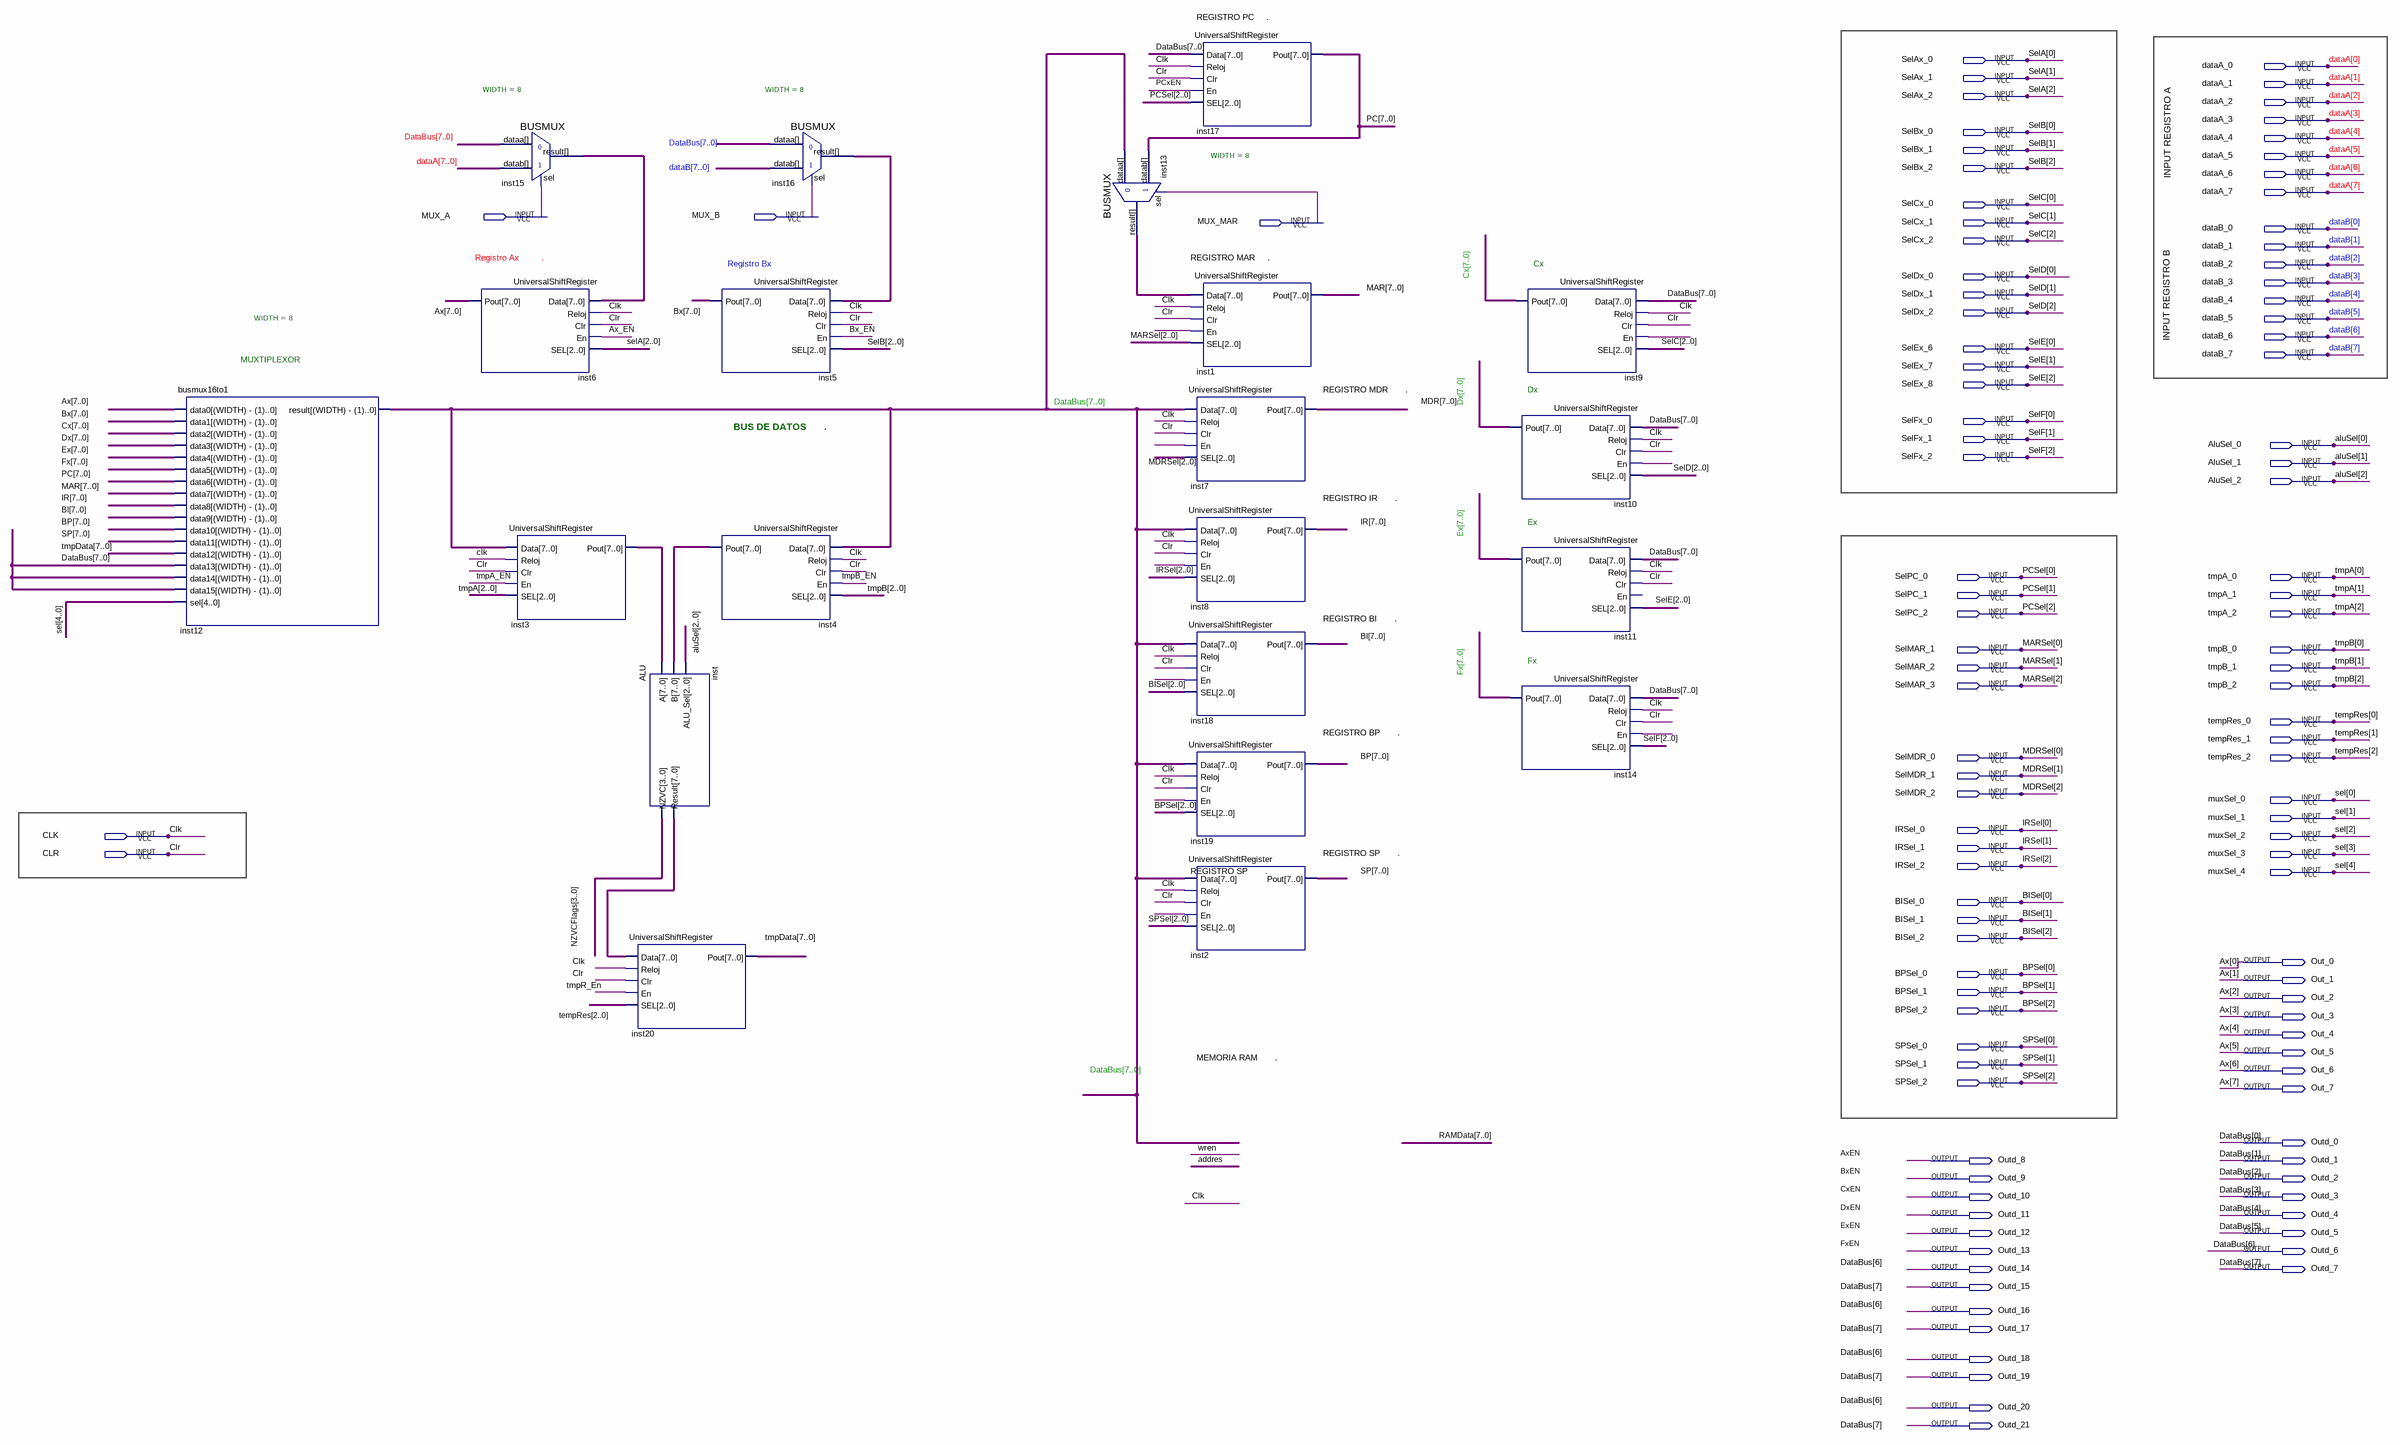
[diagram p0: schematic sheet]
// Quartus schematic ElMicro_2.bdf as structural Verilog: 21 symbols, 107 pins
module ElMicro_2 (
  input  SelAx_0,
  input  dataA_0,
  input  SelAx_1,
  input  dataA_1,
  input  SelAx_2,
  input  dataA_2,
  input  dataA_3,
  input  SelBx_0,
  input  dataA_4,
  input  SelBx_1,
  input  dataA_5,
  input  SelBx_2,
  input  dataA_6,
  input  dataA_7,
  input  SelCx_0,
  input  MUX_A,
  input  MUX_B,
  input  MUX_MAR,
  input  SelCx_1,
  input  dataB_0,
  input  SelCx_2,
  input  dataB_1,
  input  dataB_2,
  input  SelDx_0,
  input  dataB_3,
  input  SelDx_1,
  input  dataB_4,
  input  SelDx_2,
  input  dataB_5,
  input  dataB_6,
  input  SelEx_6,
  input  dataB_7,
  input  SelEx_7,
  input  SelEx_8,
  input  SelFx_0,
  input  SelFx_1,
  input  AluSel_0,
  input  SelFx_2,
  input  AluSel_1,
  input  AluSel_2,
  input  SelPC_0,
  input  tmpA_0,
  input  SelPC_1,
  input  tmpA_1,
  input  SelPC_2,
  input  tmpA_2,
  input  SelMAR_1,
  input  tmpB_0,
  input  SelMAR_2,
  input  tmpB_1,
  input  SelMAR_3,
  input  tmpB_2,
  input  tempRes_0,
  input  tempRes_1,
  input  SelMDR_0,
  input  tempRes_2,
  input  SelMDR_1,
  input  SelMDR_2,
  input  muxSel_0,
  input  muxSel_1,
  input  IRSel_0,
  input  CLK,
  input  muxSel_2,
  input  IRSel_1,
  input  CLR,
  input  muxSel_3,
  input  IRSel_2,
  input  muxSel_4,
  input  BISel_0,
  input  BISel_1,
  input  BISel_2,
  input  BPSel_0,
  input  BPSel_1,
  input  BPSel_2,
  input  SPSel_0,
  input  SPSel_1,
  input  SPSel_2,
  output Out_0,
  output Out_1,
  output Out_2,
  output Out_3,
  output Out_4,
  output Out_5,
  output Out_6,
  output Out_7,
  output Outd_0,
  output Outd_8,
  output Outd_1,
  output Outd_9,
  output Outd_2,
  output Outd_10,
  output Outd_3,
  output Outd_11,
  output Outd_4,
  output Outd_12,
  output Outd_5,
  output Outd_13,
  output Outd_6,
  output Outd_14,
  output Outd_7,
  output Outd_15,
  output Outd_16,
  output Outd_17,
  output Outd_18,
  output Outd_19,
  output Outd_20,
  output Outd_21
);

  wire Ax_EN, Bx_EN, PCxEN, tmpA_EN, tmpB_EN, tmpR_En, undriven, undriven_2, undriven_3, undriven_4,
       undriven_5, undriven_6, undriven_7, undriven_8, undriven_9, undriven_10, undriven_11, undriven_12;
  wire [3:0] NZVCFlags;
  wire [7:0] BI, BP, Bx, Cx, Dx, Ex, Fx, inst3_pout, inst4_pout, inst13_result, inst15_result, inst16_result,
       inst_result, IR, MAR, MDR, PC, SP, tmpData;

  busmux16to1 #(.WIDTH(8)) inst12 (
    .data0({Out_7, Out_6, Out_5, Out_4, Out_3, Out_2, Out_1, Out_0}), .data1(Bx), .data2(Cx), .data3(Dx),
    .data4(Ex), .data5(Fx), .data6(PC), .data7(MAR), .data8(IR), .data9(BI), .data10(BP), .data11(SP),
    .data12(tmpData), .data13({Outd_7, Outd_6, Outd_5, Outd_4, Outd_3, Outd_2, Outd_1, Outd_0}),
    .data14({Outd_7, Outd_6, Outd_5, Outd_4, Outd_3, Outd_2, Outd_1, Outd_0}),
    .data15({Outd_7, Outd_6, Outd_5, Outd_4, Outd_3, Outd_2, Outd_1, Outd_0}),
    .sel({muxSel_4, muxSel_3, muxSel_2, muxSel_1, muxSel_0}),
    .result({Outd_7, Outd_6, Outd_5, Outd_4, Outd_3, Outd_2, Outd_1, Outd_0}));
  BUSMUX #(.WIDTH(8)) inst15 (
    .datab({dataA_7, dataA_6, dataA_5, dataA_4, dataA_3, dataA_2, dataA_1, dataA_0}), .sel(undriven_3),
    .dataa({Outd_7, Outd_6, Outd_5, Outd_4, Outd_3, Outd_2, Outd_1, Outd_0}), .result(inst15_result));
  UniversalShiftRegister inst6 (
    .Data(inst15_result), .Reloj(CLK), .Clr(CLR), .En(Ax_EN), .SEL({SelAx_2, SelAx_1, SelAx_0}),
    .Pout({Out_7, Out_6, Out_5, Out_4, Out_3, Out_2, Out_1, Out_0}));
  UniversalShiftRegister inst3 (
    .Data({Outd_7, Outd_6, Outd_5, Outd_4, Outd_3, Outd_2, Outd_1, Outd_0}), .Reloj(CLK), .Clr(CLR),
    .En(tmpA_EN), .SEL({tmpA_2, tmpA_1, tmpA_0}), .Pout(inst3_pout));
  ALU inst (
    .A(inst3_pout), .B(inst4_pout), .ALU_Sel({AluSel_2, AluSel_1, AluSel_0}), .NZVC(NZVCFlags),
    .Result(inst_result));
  UniversalShiftRegister inst20 (
    .Data(inst_result), .Reloj(CLK), .Clr(CLR), .En(tmpR_En), .SEL({tempRes_2, tempRes_1, tempRes_0}),
    .Pout(tmpData));
  UniversalShiftRegister inst5 (
    .Data(inst16_result), .Reloj(CLK), .Clr(CLR), .En(Bx_EN), .SEL({SelBx_2, SelBx_1, SelBx_0}), .Pout(Bx));
  UniversalShiftRegister inst4 (
    .Data({Outd_7, Outd_6, Outd_5, Outd_4, Outd_3, Outd_2, Outd_1, Outd_0}), .Reloj(CLK), .Clr(CLR),
    .En(tmpB_EN), .SEL({tmpB_2, tmpB_1, tmpB_0}), .Pout(inst4_pout));
  BUSMUX #(.WIDTH(8)) inst16 (
    .datab({dataB_7, dataB_6, dataB_5, dataB_4, dataB_3, dataB_2, dataB_1, dataB_0}), .sel(undriven_2),
    .dataa({Outd_7, Outd_6, Outd_5, Outd_4, Outd_3, Outd_2, Outd_1, Outd_0}), .result(inst16_result));
  BUSMUX #(.WIDTH(8)) inst13 (
    .datab(PC), .sel(undriven), .dataa({Outd_7, Outd_6, Outd_5, Outd_4, Outd_3, Outd_2, Outd_1, Outd_0}),
    .result(inst13_result));
  UniversalShiftRegister inst17 (
    .Data({Outd_7, Outd_6, Outd_5, Outd_4, Outd_3, Outd_2, Outd_1, Outd_0}), .Reloj(CLK), .Clr(CLR),
    .En(PCxEN), .SEL({SelPC_2, SelPC_1, SelPC_0}), .Pout(PC));
  UniversalShiftRegister inst1 (
    .Data(inst13_result), .Reloj(CLK), .Clr(CLR), .En(undriven_11), .SEL({SelMAR_3, SelMAR_2, SelMAR_1}),
    .Pout(MAR));
  UniversalShiftRegister inst7 (
    .Data({Outd_7, Outd_6, Outd_5, Outd_4, Outd_3, Outd_2, Outd_1, Outd_0}), .Reloj(CLK), .Clr(CLR),
    .En(undriven_12), .SEL({SelMDR_2, SelMDR_1, SelMDR_0}), .Pout(MDR));
  UniversalShiftRegister inst8 (
    .Data({Outd_7, Outd_6, Outd_5, Outd_4, Outd_3, Outd_2, Outd_1, Outd_0}), .Reloj(CLK), .Clr(CLR),
    .En(undriven_10), .SEL({IRSel_2, IRSel_1, IRSel_0}), .Pout(IR));
  UniversalShiftRegister inst18 (
    .Data({Outd_7, Outd_6, Outd_5, Outd_4, Outd_3, Outd_2, Outd_1, Outd_0}), .Reloj(CLK), .Clr(CLR),
    .En(undriven_9), .SEL({BISel_2, BISel_1, BISel_0}), .Pout(BI));
  UniversalShiftRegister inst19 (
    .Data({Outd_7, Outd_6, Outd_5, Outd_4, Outd_3, Outd_2, Outd_1, Outd_0}), .Reloj(CLK), .Clr(CLR),
    .En(undriven_7), .SEL({BPSel_2, BPSel_1, BPSel_0}), .Pout(BP));
  UniversalShiftRegister inst2 (
    .Data({Outd_7, Outd_6, Outd_5, Outd_4, Outd_3, Outd_2, Outd_1, Outd_0}), .Reloj(CLK), .Clr(CLR),
    .En(undriven_8), .SEL({SPSel_2, SPSel_1, SPSel_0}), .Pout(SP));
  UniversalShiftRegister inst9 (
    .Data({Outd_7, Outd_6, Outd_5, Outd_4, Outd_3, Outd_2, Outd_1, Outd_0}), .Reloj(CLK), .Clr(CLR),
    .En(undriven_4), .SEL({SelCx_2, SelCx_1, SelCx_0}), .Pout(Cx));
  UniversalShiftRegister inst10 (
    .Data({Outd_7, Outd_6, Outd_5, Outd_4, Outd_3, Outd_2, Outd_1, Outd_0}), .Reloj(CLK), .Clr(CLR),
    .En(undriven_5), .SEL({SelDx_2, SelDx_1, SelDx_0}), .Pout(Dx));
  UniversalShiftRegister inst11 (
    .Data({Outd_7, Outd_6, Outd_5, Outd_4, Outd_3, Outd_2, Outd_1, Outd_0}), .Reloj(CLK), .Clr(CLR),
    .SEL({SelEx_8, SelEx_7, SelEx_6}), .Pout(Ex));  // open: En
  UniversalShiftRegister inst14 (
    .Data({Outd_7, Outd_6, Outd_5, Outd_4, Outd_3, Outd_2, Outd_1, Outd_0}), .Reloj(CLK), .Clr(CLR),
    .En(undriven_6), .SEL({SelFx_2, SelFx_1, SelFx_0}), .Pout(Fx));

  assign Outd_14 = Outd_6;
  assign Outd_15 = Outd_7;
  assign Outd_16 = Outd_6;
  assign Outd_17 = Outd_7;
  assign Outd_18 = Outd_6;
  assign Outd_19 = Outd_7;
  assign Outd_20 = Outd_6;
  assign Outd_21 = Outd_7;

  // Other names for the same wires on the sheet: aluSel[2:0] = {AluSel_2, AluSel_1, AluSel_0};
  //   Ax[7:0] = {Out_7, Out_6, Out_5, Out_4, Out_3, Out_2, Out_1, Out_0}; AxEN = Outd_8;
  //   BISel[2:0] = {BISel_2, BISel_1, BISel_0}; BPSel[2:0] = {BPSel_2, BPSel_1, BPSel_0}; BxEN = Outd_9;
  //   CxEN = Outd_10; dataA[7:0] = {dataA_7, dataA_6, dataA_5, dataA_4, dataA_3, dataA_2, dataA_1, dataA_0};
  //   dataB[7:0] = {dataB_7, dataB_6, dataB_5, dataB_4, dataB_3, dataB_2, dataB_1, dataB_0};
  //   DataBus[7:0] = {Outd_7, Outd_6, Outd_5, Outd_4, Outd_3, Outd_2, Outd_1, Outd_0}; DxEN = Outd_11; ExEN = Outd_12;
  //   FxEN = Outd_13; IRSel[2:0] = {IRSel_2, IRSel_1, IRSel_0};
  //   sel[4:0] = {muxSel_4, muxSel_3, muxSel_2, muxSel_1, muxSel_0}; selA[2:0] = {SelAx_2, SelAx_1, SelAx_0};
  //   SelB[2:0] = {SelBx_2, SelBx_1, SelBx_0}; SelC[2:0] = {SelCx_2, SelCx_1, SelCx_0};
  //   SelD[2:0] = {SelDx_2, SelDx_1, SelDx_0}; SelE[2:0] = {SelEx_8, SelEx_7, SelEx_6};
  //   SelF[2:0] = {SelFx_2, SelFx_1, SelFx_0}; MARSel[2:0] = {SelMAR_3, SelMAR_2, SelMAR_1};
  //   MDRSel[2:0] = {SelMDR_2, SelMDR_1, SelMDR_0}; PCSel[2:0] = {SelPC_2, SelPC_1, SelPC_0};
  //   SPSel[2:0] = {SPSel_2, SPSel_1, SPSel_0}; tempRes[2:0] = {tempRes_2, tempRes_1, tempRes_0};
  //   tmpA[2:0] = {tmpA_2, tmpA_1, tmpA_0}; tmpB[2:0] = {tmpB_2, tmpB_1, tmpB_0}

  // Notes on the sheet:
  //   REGISTRO PC     .
  //   INPUT REGISTRO A        
  //   INPUT REGISTRO B        
  //   Registro Ax         .
  //   REGISTRO MAR     .
  //   Registro Bx     
  //   Cx
  //   MUXTIPLEXOR
  //   REGISTRO MDR       .
  //   Dx
  //   BUS DE DATOS       . 
  //   REGISTRO IR       .
  //   Ex
  //   REGISTRO BI       .
  //   Fx
  //   REGISTRO BP       .
  //   REGISTRO SP       .
  //   REGISTRO SP       .
  //   MEMORIA RAM       .
endmodule
